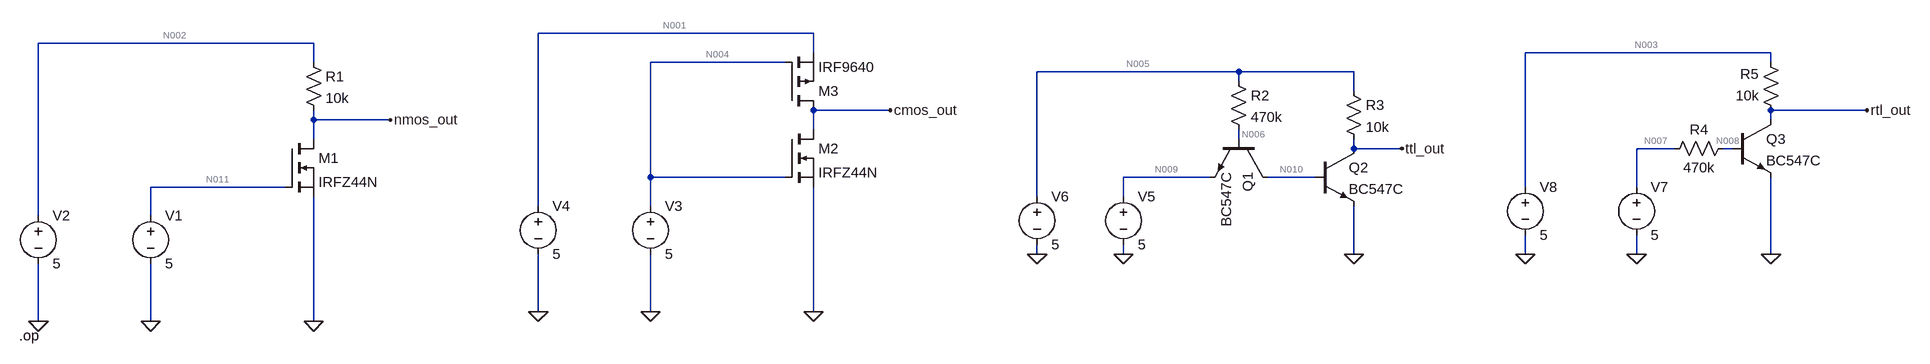
[diagram p0: schematic tod.asc]
tod.asc, the LTspice schematic file:
Version 4
SHEET 1 2076 680
WIRE 128 -208 -336 -208
WIRE -752 -192 -1216 -192
WIRE 128 -176 128 -208
WIRE 1824 -176 1408 -176
WIRE -752 -160 -752 -192
WIRE 80 -160 -144 -160
WIRE 1824 -160 1824 -176
WIRE 880 -144 544 -144
WIRE 1072 -144 880 -144
WIRE 880 -128 880 -144
WIRE 1072 -112 1072 -144
WIRE 128 -80 128 -96
WIRE 256 -80 128 -80
WIRE 1984 -80 1824 -80
WIRE -752 -64 -752 -80
WIRE -624 -64 -752 -64
WIRE 1824 -64 1824 -80
WIRE 128 -48 128 -80
WIRE -752 -32 -752 -64
WIRE 880 -32 880 -48
WIRE 1072 -16 1072 -32
WIRE 1152 -16 1072 -16
WIRE 1664 -16 1600 -16
WIRE 1760 -16 1744 -16
WIRE -144 32 -144 -160
WIRE 80 32 -144 32
WIRE 832 32 688 32
WIRE 1008 32 928 32
WIRE -800 48 -1024 48
WIRE 1408 48 1408 -176
WIRE 1600 48 1600 -16
WIRE 544 64 544 -144
WIRE 688 64 688 32
WIRE -336 80 -336 -208
WIRE -144 80 -144 32
WIRE -1216 96 -1216 -192
WIRE -1024 96 -1024 48
WIRE 544 160 544 144
WIRE 688 160 688 144
WIRE 1072 160 1072 80
WIRE 1408 160 1408 128
WIRE 1600 160 1600 128
WIRE 1824 160 1824 32
WIRE -336 256 -336 160
WIRE -144 256 -144 160
WIRE 128 256 128 48
WIRE -1216 272 -1216 176
WIRE -1024 272 -1024 176
WIRE -752 272 -752 64
FLAG -624 -64 nmos_out
FLAG -752 272 0
FLAG -1024 272 0
FLAG -1216 272 0
FLAG 256 -80 cmos_out
FLAG 128 256 0
FLAG -144 256 0
FLAG -336 256 0
FLAG 688 160 0
FLAG 544 160 0
FLAG 1072 160 0
FLAG 1152 -16 ttl_out
FLAG 1408 160 0
FLAG 1600 160 0
FLAG 1824 160 0
FLAG 1984 -80 rtl_out
SYMBOL nmos -800 -32 R0
SYMATTR InstName M1
SYMATTR Value IRFZ44N
SYMBOL res -768 -176 R0
SYMATTR InstName R1
SYMATTR Value 10k
SYMBOL voltage -1024 80 R0
WINDOW 123 0 0 Left 0
WINDOW 39 0 0 Left 0
SYMATTR InstName V1
SYMATTR Value 5
SYMBOL voltage -1216 80 R0
WINDOW 123 0 0 Left 0
WINDOW 39 0 0 Left 0
SYMATTR InstName V2
SYMATTR Value 5
SYMBOL nmos 80 -48 R0
SYMATTR InstName M2
SYMATTR Value IRFZ44N
SYMBOL voltage -144 64 R0
WINDOW 123 0 0 Left 0
WINDOW 39 0 0 Left 0
SYMATTR InstName V3
SYMATTR Value 5
SYMBOL voltage -336 64 R0
WINDOW 123 0 0 Left 0
WINDOW 39 0 0 Left 0
SYMATTR InstName V4
SYMATTR Value 5
SYMBOL pmos 80 -80 M180
SYMATTR InstName M3
SYMATTR Value IRF9640
SYMBOL npn 928 -32 R90
SYMATTR InstName Q1
SYMATTR Value BC547C
SYMBOL npn 1008 -16 R0
SYMATTR InstName Q2
SYMATTR Value BC547C
SYMBOL res 864 -144 R0
SYMATTR InstName R2
SYMATTR Value 470k
SYMBOL res 1056 -128 R0
SYMATTR InstName R3
SYMATTR Value 10k
SYMBOL voltage 688 48 R0
WINDOW 123 0 0 Left 0
WINDOW 39 0 0 Left 0
SYMATTR InstName V5
SYMATTR Value 5
SYMBOL voltage 544 48 R0
WINDOW 123 0 0 Left 0
WINDOW 39 0 0 Left 0
SYMATTR InstName V6
SYMATTR Value 5
SYMBOL npn 1760 -64 R0
SYMATTR InstName Q3
SYMATTR Value BC547C
SYMBOL res 1760 -32 R90
WINDOW 0 0 56 VBottom 2
WINDOW 3 32 56 VTop 2
SYMATTR InstName R4
SYMATTR Value 470k
SYMBOL res 1840 -64 R180
WINDOW 0 36 76 Left 2
WINDOW 3 36 40 Left 2
SYMATTR InstName R5
SYMATTR Value 10k
SYMBOL voltage 1600 32 R0
WINDOW 123 0 0 Left 0
WINDOW 39 0 0 Left 0
SYMATTR InstName V7
SYMATTR Value 5
SYMBOL voltage 1408 32 R0
WINDOW 123 0 0 Left 0
WINDOW 39 0 0 Left 0
SYMATTR InstName V8
SYMATTR Value 5
TEXT -1248 296 Left 2 !.op

The netlist it stands for:
* tod.asc
M1 nmos_out N011 0 0 IRFZ44N
R1 N002 nmos_out 10k
V1 N011 0 5
V2 N002 0 5
M2 cmos_out N004 0 0 IRFZ44N
V3 N004 0 5
V4 N001 0 5
M3 cmos_out N004 N001 N001 IRF9640
Q1 N010 N006 N009 0 BC547C
Q2 ttl_out N010 0 0 BC547C
R2 N005 N006 470k
R3 N005 ttl_out 10k
V5 N009 0 5
V6 N005 0 5
Q3 rtl_out N008 0 0 BC547C
R4 N008 N007 470k
R5 rtl_out N003 10k
V7 N007 0 5
V8 N003 0 5
.model NPN NPN
.model PNP PNP
.lib standard.bjt
.model NMOS NMOS
.model PMOS PMOS
.lib standard.mos
.op
.backanno
.end

* Results of the author's LTspice run, read from the files saved beside the schematic
* Operating Point:
*   V(nmos_out) = 28.82 µV
*   V(n011) = 5 V
*   V(n002) = 5 V
*   V(cmos_out) = 2.766 pV
*   V(n004) = 5 V
*   V(n001) = 5 V
*   V(n010) = 626.7 mV
*   V(n006) = 1.182 V
*   V(n009) = 5 V
*   V(ttl_out) = 12.41 mV
*   V(n005) = 5 V
*   V(rtl_out) = 52.42 mV
*   V(n008) = 607.2 mV
*   V(n007) = 5 V
*   V(n003) = 5 V
*   Ic(Q3) = 494.8 µA
*   Ib(Q3) = 9.346 µA
*   Ie(Q3) = -504.1 µA
*   Ic(Q2) = 498.8 µA
*   Ib(Q2) = 74.33 µA
*   Ie(Q2) = -573.1 µA
*   Ic(Q1) = -74.33 µA
*   Ib(Q1) = 8.123 µA
*   Ie(Q1) = 66.2 µA
*   Id(M3) = 136.8 pA
*   Ig(M3) = -179.8 pA
*   Is(M3) = 43 pA
*   Id(M2) = 2.048 nA
*   Ig(M2) = -2 nA
*   Is(M2) = -47.99 pA
*   Id(M1) = 500 µA
*   Ig(M1) = -2 nA
*   Is(M1) = -500 µA
*   I(R5) = -494.8 µA
*   I(R4) = -9.346 µA
*   I(R3) = 498.8 µA
*   I(R2) = 8.123 µA
*   I(R1) = 500 µA
*   I(V8) = -494.8 µA
*   I(V7) = -9.346 µA
*   I(V6) = -506.9 µA
*   I(V5) = -66.2 µA
*   I(V4) = -48 pA
*   I(V3) = 0 A
*   I(V2) = -500 µA
*   I(V1) = 0 A
* From the log:
*   Semiconductor Device Operating Points:
*                           --- Bipolar Transistors ---
*   Name:       q3          q2          q1
*   Model:    bc547c      bc547c      bc547c
*   Ib:       9.35e-06    7.43e-05    8.12e-06
*   Ic:       4.95e-04    4.99e-04   -7.43e-05
*   Vbe:      6.07e-01    6.27e-01   -3.82e+00
*   Vbc:      5.55e-01    6.14e-01    5.55e-01
*   Vce:      5.24e-02    1.24e-02   -4.37e+00
*   BetaDC:   5.29e+01    6.71e+00   -9.15e+00
*   Gm:       1.92e-02    2.17e-02   -2.51e-03
*   Rpi:      2.07e+04    9.82e+03    1.00e+12
*   Rx:       1.00e+00    1.00e+00    1.00e+00
*   Ro:       4.04e+02    4.28e+01    3.99e+02
*   Cbe:      4.12e-11    5.33e-11    6.12e-12
*   Cbc:      1.56e-11    1.73e-11    1.56e-11
*   Cjs:      0.00e+00    0.00e+00    0.00e+00
*   BetaAC:   3.96e+02    2.13e+02   -2.51e+09
*   Cbx:      9.61e-12    1.07e-11    9.62e-12
*   Ft:       4.59e+07    4.25e+07    1.27e+07
*                           --- VDMOSFET Transistors ---
*   Name:          m3          m2          m1
*   Model:       irf9640     irfz44n     irfz44n
*   Id:          1.37e-10    2.05e-09    5.00e-04
*   Vgs:         0.00e+00    5.00e+00    5.00e+00
*   Vds:        -5.00e+00    2.77e-12    2.88e-05
*   Vth:        -3.50e+00    4.00e+00    4.00e+00
*   Gm:          3.53e-31    4.80e-11    5.00e-04
*   Gds:         1.77e-34    1.90e+01    1.90e+01
*   Cgs:         1.00e-09    1.40e-09    1.40e-09
*   Cgd:         1.80e-10    2.00e-09    2.00e-09
*   Cbody:       4.08e-10    9.00e-10    9.00e-10